# Altium schematic sheet sound.SchDoc: Sound
size A4; DocumentNumber: 10; SheetNumber: 10; SheetTotal: 11
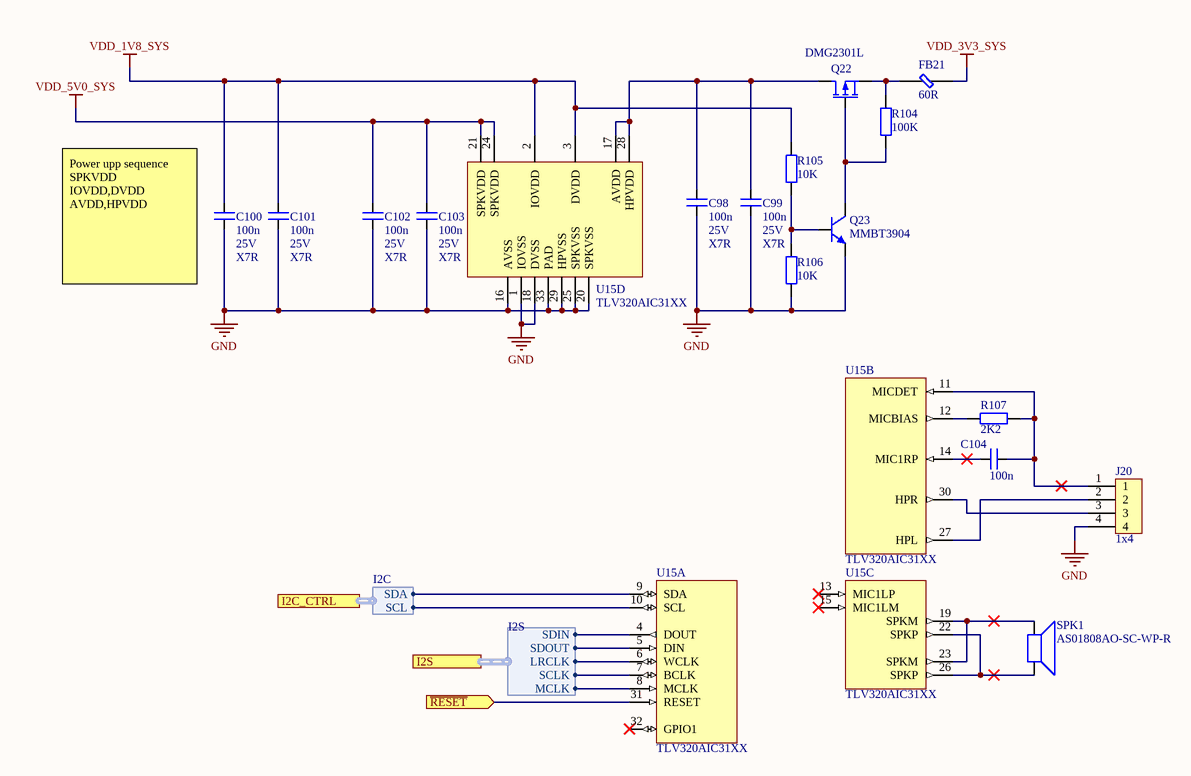
[diagram p0: sound.SchDoc]

## Parts
C98  value 100n  Voltage: 25V  Type: X7R  [C1005[0402]]  (hidden comment: cap)
C99  value 100n  Voltage: 25V  Type: X7R  [C1005[0402]]  (hidden comment: cap)
C100  value 100n  Voltage: 25V  Type: X7R  [C1005[0402]]  (hidden comment: cap)
C101  value 100n  Voltage: 25V  Type: X7R  [C1005[0402]]  (hidden comment: cap)
C102  value 100n  Voltage: 25V  Type: X7R  [C1005[0402]]  (hidden comment: cap)
C103  value 100n  Voltage: 25V  Type: X7R  [C1005[0402]]  (hidden comment: cap)
C104  value 100n  [C1005[0402]]  (hidden comment: cap)
FB21  value 60R  [FBC1608X07N]  (hidden comment: Ferrite bead)
J20  1x4  [molex_picoblade_1x4]
Q22  DMG2301L  [NCH_SOT95P237X110-3N]
Q23  MMBT3904  [NPN_SOT95P230X110-3N]
R104  value 100K  [R1005[0402]]  (hidden comment: res)
R105  value 10K  [R1005[0402]]  (hidden comment: res)
R106  value 10K  [R1005[0402]]  (hidden comment: res)
R107  value 2K2  [R1005[0402]]  (hidden comment: res)
SPK1  AS01808AO-SC-WP-R  [pui_audio_speaker]
U15  TLV320AIC31XX  [TI_QFN50P500X500X100_HS-33M]  (parts A,B,C,D of 4)

## Ports
I2C_CTRL (harness I2C), I2S (harness I2S), ~{RESET} (in)

## Harnesses
I2S: MCLK, LRCLK, SCLK, SDOUT, SDIN
I2C: SCL, SDA

## Nets
GND: C98.1 C99.1 C100.1 C101.1 C102.1 C103.1 J20.4 Q23.E R106.1 U15.1(IOVSS) U15.16(AVSS) U15.18(DVSS) U15.20(SPKVSS) U15.25(SPKVSS) U15.29(HPVSS) U15.33(PAD)
VDD_1V8_SYS: C100.2 C101.2 R105.1 U15.2(IOVDD) U15.3(DVDD)
VDD_3V3_SYS: FB21.1
VDD_5V0_SYS: C102.2 C103.2 U15.21(SPKVDD) U15.24(SPKVDD)
~{RESET}: U15.31(RESET) ; port ~{RESET}
NetC98_2: C98.2 C99.2 Q22.D U15.17(AVDD) U15.28(HPVDD)
NetC104_1: C104.1 U15.14(MIC1RP)
NetC104_2: C104.2 J20.1 R107.1 U15.11(MICDET)
NetFB21_2: FB21.2 Q22.S R104.2
NetJ20_2: J20.2 U15.27(HPL)
NetJ20_3: J20.3 U15.30(HPR)
NetQ22_G: Q22.G Q23.C R104.1
NetQ23_B: Q23.B R105.2 R106.2
NetR107_2: R107.2 U15.12(MICBIAS)
NetSPK1_1: SPK1.1 U15.19(SPKM) U15.23(SPKM)
NetSPK1_2: SPK1.2 U15.22(SPKP) U15.26(SPKP)
NetU15_4: U15.4(DOUT) ; port I2S.SDIN
NetU15_5: U15.5(DIN) ; port I2S.SDOUT
NetU15_6: U15.6(WCLK) ; port I2S.LRCLK
NetU15_7: U15.7(BCLK) ; port I2S.SCLK
NetU15_8: U15.8(MCLK) ; port I2S.MCLK
NetU15_9: U15.9(SDA) ; port I2C_CTRL.SDA
NetU15_10: U15.10(SCL) ; port I2C_CTRL.SCL

Not connected (* = marked no-connect by the designer): U15 13(MIC1LP)* 15(MIC1LM)* 32(GPIO1)*

## Notes on the sheet
- (near C100) Power upp sequence
  SPKVDD
  IOVDD,DVDD
  AVDD,HPVDD
- Title
- Size:
- Date:
- A4
- Number:
- Time:
- Revision:
- Sheet
- of
- Repo:

## Library data of the parts
C98-C103 = cap: Capacitor; Manufacturer: *; Series: *
C104 = cap: Capacitor; Voltage: 25V; Type: X7R; Manufacturer: *; Series: *
FB21 = ferrite_bead: Frequency: 100M
J20 = header_1x4
Q22 = pch_mosfet
Q23 = npn_bipolar: NPN Bipolar Transistor; Published: 8-Jun-2000; LatestRevisionDate: 17-Jul-2002; LatestRevisionNote: Re-released for DXP Platform.; PackageReference: TO-226-AA; Publisher: Altium Limited; PackageDescription: TO, Flat Index; 3 In-Line, Axial Leads; Body Dia. 4.8mm; Leads 0.55 x 0.51 mm (max); Code_JEDEC: TO-226-AA
R104-R107 = res: Resistor
SPK1 = speaker
U15 = tlv320aic3100